# Altium schematic sheet Cell_SARA-G350-02S.SchDoc
size Letter
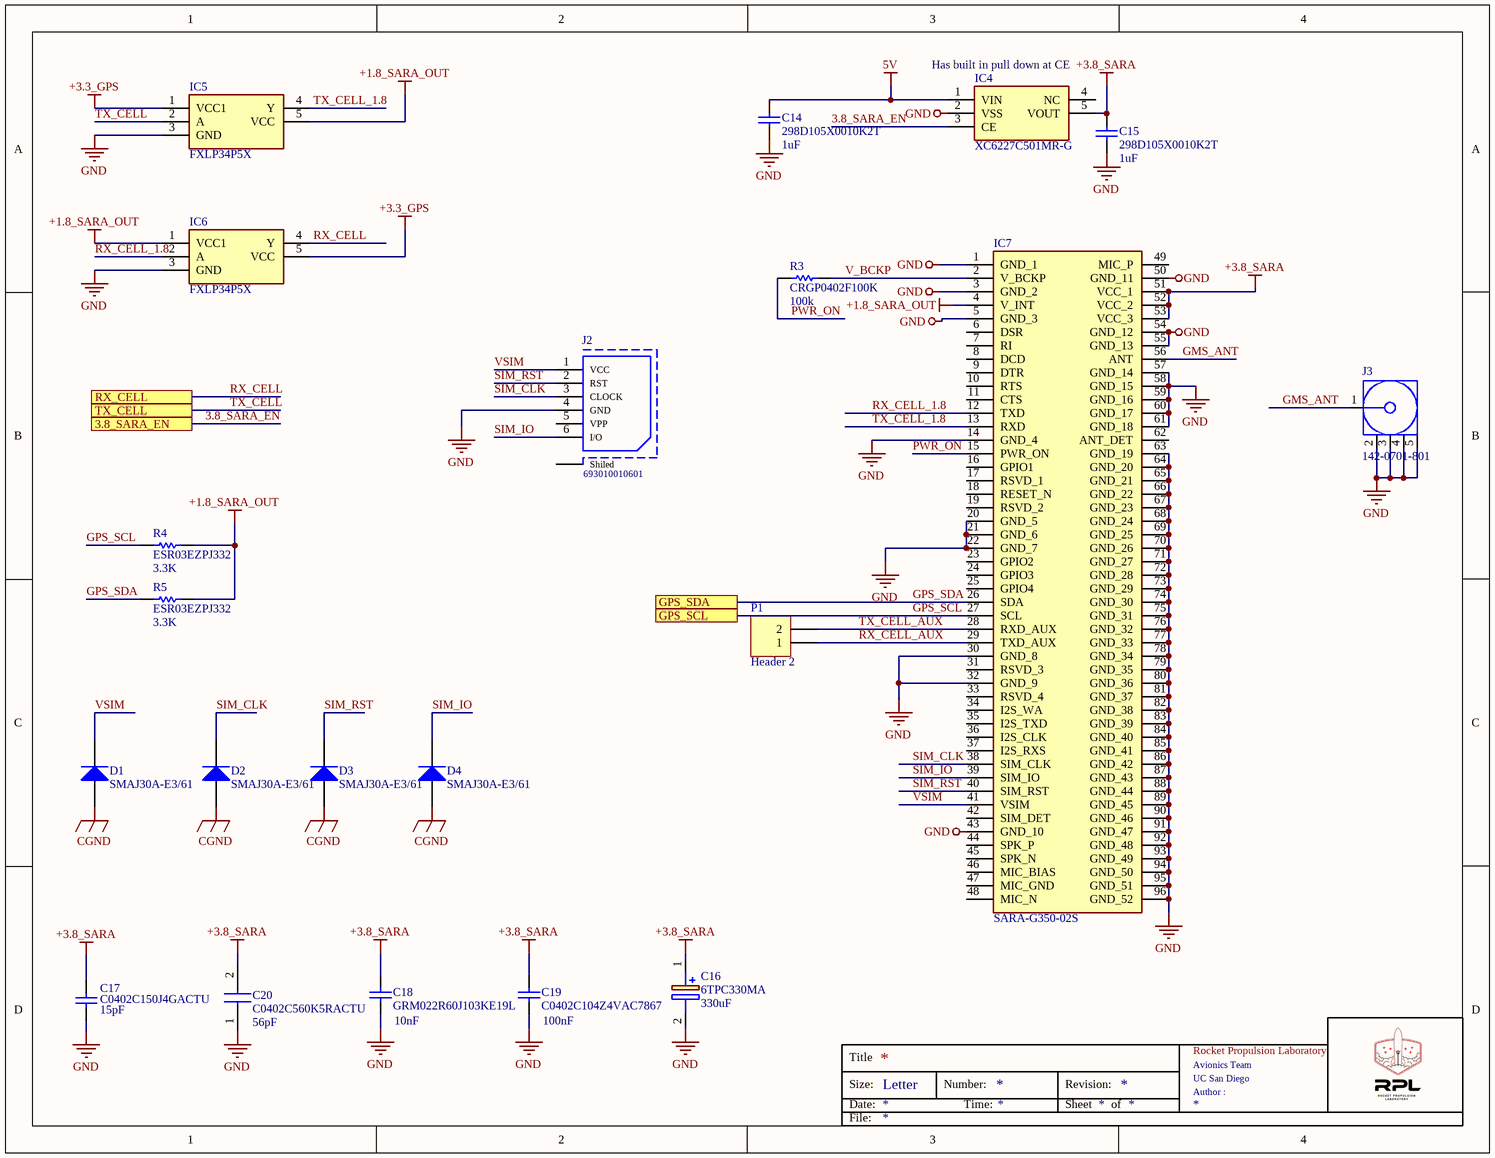
[diagram p0: Cell_SARA-G350-02S.SchDoc]

## Parts
C14  298D105X0010K2T  value 1uF  [0402]
C15  298D105X0010K2T  value 1uF  [0402]
C16  6TPC330MA  spec: 330uF  [CAPPM7343X200N]
C17  C0402C150J4GACTU  value 15pF  [CAPC0402(1005)60_L]
C18  GRM022R60J103KE19L  Spec: 10nF  [CAPC1005X55X25NL05T10]
C19  C0402C104Z4VAC7867  Spec: 100nF  [CAPC1005X60X30LL05T10]
C20  C0402C560K5RACTU  spec: 56pF  [CAPC1005X55N]
D1  SMAJ30A-E3/61  [VISH-DO-214AC-2_N]
D2  SMAJ30A-E3/61  [VISH-DO-214AC-2_N]
D3  SMAJ30A-E3/61  [VISH-DO-214AC-2_N]
D4  SMAJ30A-E3/61  [VISH-DO-214AC-2_N]
IC4  XC6227C501MR-G  [SOT95P280X130-5N]
IC5  FXLP34P5X  [SOT65P210X110-5N]
IC6  FXLP34P5X  [SOT65P210X110-5N]
IC7  SARA-G350-02S  [SARA-G350_1]
J2  693010010601  [693010010601]
J3  142-0701-801  [CINC-142-0701-801_V]
P1  Header 2  [HDR1X2]
R3  CRGP0402F100K  value 100k  [0402]
R4  ESR03EZPJ332  value 3.3K  [1608[0603]]
R5  ESR03EZPJ332  value 3.3K  [1608[0603]]

## Ports
3.8_SARA_EN, GPS_SCL, GPS_SDA, RX_CELL, TX_CELL

## Nets
5V: C14.2 IC4.1(VIN)
+1.8_SARA_OUT: IC5.5(VCC) IC6.1(VCC1) IC7.4(V_INT) R4.2 R5.2
+3.3_GPS: IC5.1(VCC1) IC6.5(VCC)
+3.8_SARA: C15.2 C16.1(+) C17.2 C18.2 C19.2 C20.2 IC4.5(VOUT) IC7.51(VCC_1) IC7.52(VCC_2) IC7.53(VCC_3)
CGND: D1.2(A) D2.2(A) D3.2(A) D4.2(A)
GND: C14.1 C15.1 C16.2(-) C17.1 C18.1 C19.1 C20.1 IC4.2(VSS) IC5.3(GND) IC6.3(GND) IC7.1(GND_1) IC7.3(GND_2) IC7.5(GND_3) IC7.14(GND_4) IC7.20(GND_5) IC7.21(GND_6) IC7.22(GND_7) IC7.30(GND_8) IC7.32(GND_9) IC7.43(GND_10) IC7.50(GND_11) IC7.54(GND_12) IC7.55(GND_13) IC7.57(GND_14) IC7.58(GND_15) IC7.59(GND_16) IC7.60(GND_17) IC7.61(GND_18) IC7.63(GND_19) IC7.64(GND_20) IC7.65(GND_21) IC7.66(GND_22) IC7.67(GND_23) IC7.68(GND_24) IC7.69(GND_25) IC7.70(GND_26) IC7.71(GND_27) IC7.72(GND_28) IC7.73(GND_29) IC7.74(GND_30) IC7.75(GND_31) IC7.76(GND_32) IC7.77(GND_33) IC7.78(GND_34) IC7.79(GND_35) IC7.80(GND_36) IC7.81(GND_37) IC7.82(GND_38) IC7.83(GND_39) IC7.84(GND_40) IC7.85(GND_41) IC7.86(GND_42) IC7.87(GND_43) IC7.88(GND_44) IC7.89(GND_45) IC7.90(GND_46) IC7.91(GND_47) IC7.92(GND_48) IC7.93(GND_49) IC7.94(GND_50) IC7.95(GND_51) IC7.96(GND_52) J2.4(GND) J3.2 J3.3 J3.4 J3.5
3.8_SARA_EN: IC4.3(CE) ; port 3.8_SARA_EN
GMS_ANT: IC7.56(ANT) J3.1
GPS_SCL: IC7.27(SCL) R4.1 ; port GPS_SCL
GPS_SDA: IC7.26(SDA) R5.1 ; port GPS_SDA
PWR_ON: IC7.15(PWR_ON) R3.2
RX_CELL: IC6.4(Y) ; port RX_CELL
RX_CELL_1.8: IC6.2(A) IC7.12(TXD)
RX_CELL_AUX: IC7.29(TXD_AUX) P1.1
SIM_CLK: D2.1(K) IC7.38(SIM_CLK) J2.3(CLOCK)
SIM_IO: D4.1(K) IC7.39(SIM_IO) J2.6(I/O)
SIM_RST: D3.1(K) IC7.40(SIM_RST) J2.2(RST)
TX_CELL: IC5.2(A) ; port TX_CELL
TX_CELL_1.8: IC5.4(Y) IC7.13(RXD)
TX_CELL_AUX: IC7.28(RXD_AUX) P1.2
V_BCKP: IC7.2(V_BCKP) R3.1
VSIM: D1.1(K) IC7.41(VSIM) J2.1(VCC)

Not connected (* = marked no-connect by the designer): IC4 4(NC); IC7 6(DSR) 7(RI) 8(DCD) 9(DTR) 10(RTS) 11(CTS) 16(GPIO1) 17(RSVD_1) 18(RESET_N) 19(RSVD_2) 23(GPIO2) 24(GPIO3) 25(GPIO4) 31(RSVD_3) 33(RSVD_4) 34(I2S_WA) 35(I2S_TXD) 36(I2S_CLK) 37(I2S_RXS) 42(SIM_DET) 44(SPK_P) 45(SPK_N) 46(MIC_BIAS) 47(MIC_GND) 48(MIC_N) 49(MIC_P) 62(ANT_DET); J2 5(VPP) Shiled

## Notes on the sheet
- (near IC4) Has built in pull down at CE
- Title
- Size:
- Date:
- Letter
- Number:
- Time:
- Revision:
- Sheet
- of
- Rocket Propulsion Laboratory
- UC San Diego
- Avionics Team
- Author :
- File:

## Library data of the parts
C14 C15 = Cap: Capacitor; Published: 8-Jun-2000; LatestRevisionDate: 17-Jul-2002; LatestRevisionNote: Re-released for DXP Platform.; PackageReference: RAD-0.3; Publisher: Altium Limited; PackageDescription: Radial Cap, Thru-Hole; 2 Leads; 0.3 in Pin Spacing
C16 = 6TPC330MA: Capacitor Polarised; Manufacturer_Name: Panasonic; Datasheet Link: https://industrial.panasonic.com/cdbs/www-data/pdf/AAA8000/AAA8000C68.pdf; Height: 2mm; Manufacturer_Part_Number: 6TPC330MA; Mouser Part Number: 667-6TPC330MA; Mouser Price/Stock: https://www.mouser.com/Search/Refine.aspx?Keyword=667-6TPC330MA; RS Part Number: 7887368P; RS Price/Stock: http://au.rs-online.com/web/p/products/7887368P
C17 = CMP-1034-00802-1: CAP 15pF 16V ±5% 0402 (1005 Metric) Thickness 0.6mm SMD; Case-EIA: 0402; Case-Metric: 1005; Tolerance: Â±5%; Max Thickness: 0.6 mm; Technology: SMT; Rated Voltage: 16 V
C18 = CMP-2008-04044-1: Manufacturer: Murata; Part Number: GRM022R60J103KE19L
C19 = CMP-2008-02369-1: Manufacturer: Kemet; Part Number: C0402C104Z4VAC7867
C20 = C0402C560K5RACTU: Capacitor; Manufacturer_Name: Kemet; Datasheet Link: https://content.kemet.com/datasheets/KEM_C1002_X7R_SMD.pdf; Height: 0.55mm; Manufacturer_Part_Number: C0402C560K5RACTU; Mouser Part Number: 80-C0402C560K5RACTU; Mouser Price/Stock: https://www.mouser.com/Search/Refine.aspx?Keyword=80-C0402C560K5RACTU
D1-D4 = CMP-0548-00228-2: Transient Voltage Suppressor, 6.40 to 231 V, 30 V Stand-off Voltage, Uni-Directional, -55 to 155 degC, 2-pin DO-214AC, Pb-Free, Tape and Reel; Manufacturer: Vishay Semiconductor; ID (uA): 1; VWM (V): 30; IFSM: 40 A; PPPM (W): 400, 300; VBR Uni-Directional (V): 6.4 to 231; Mounting Technology: Surface Mount; Packing: Tape and Reel; ComponentLink1URL: http://www.vishay.com/; ComponentLink3URL: http://www.vishay.com/docs/88390/smaj50a.pdf; DatasheetVersion: 12/8/2013; RoHS: TRUE; PartNumber: SMAJ30A-E3/61; PackageReference: DO-214AC-2; ComponentLink2URL: http://www.vishay.com/docs/88390/smaj50a.pdf; ComponentLink1Description: Manufacturer URL; Operating Junction and Storage Temperature Range: -55 to 150 degC; PackageDescription: 2-Pin DO-214AC (SMA), Body 4.245 x 2.665 mm; ComponentLink3Description: Package Specification; ComponentLink2Description: Datasheet
IC4 = XC6227C501MR-G: Integrated Circuit; Manufacturer_Name: Torex; Datasheet Link: https://www.torexsemi.com/file/xc6227/XC6227.pdf; Height: 1.3mm; Manufacturer_Part_Number: XC6227C501MR-G; Arrow Part Number: XC6227C501MR-G; Mouser Part Number: 865-XC6227C501MR-G; Mouser Price/Stock: https://www.mouser.co.uk/ProductDetail/Torex-Semiconductor/XC6227C501MR-G?qs=AsjdqWjXhJ85%252BgmQqME4lA%3D%3D
IC5 IC6 = FXLP34P5X: Integrated Circuit; Manufacturer_Name: ON Semiconductor; Datasheet Link: https://www.onsemi.com/pub/Collateral/FXLP34-D.pdf; Height: 1.1mm; Manufacturer_Part_Number: FXLP34P5X; Arrow Part Number: FXLP34P5X; Arrow Price/Stock: https://www.arrow.com/en/products/fxlp34p5x/on-semiconductor; Mouser Part Number: 512-FXLP34P5X; Mouser Price/Stock: https://www.mouser.com/Search/Refine.aspx?Keyword=512-FXLP34P5X
IC7 = SARA-G350-02S: Integrated Circuit; Manufacturer_Name: U-Blox; Datasheet Link: https://www.u-blox.com/sites/default/files/SARA-G3_DataSheet_%28UBX-13000993%29.pdf; Manufacturer_Part_Number: SARA-G350-02S
J2 = CMP-1502-00154-1: WR-CRD Mini SIM Card Connector Header; Manufacturer: Wurth Elektronik; Working Voltage: 50VAC; Rated Current: 0.5A; Withstanding Voltage: 500VAC; Publisher: WurthElektronik; Part Number: 693010010601; Operating Temperature: -25to85degC; Packaging: TapeandReel; Datasheet URL: https://katalog.we-online.de/em/datasheet/693010010601.pdf; Package Reference: 693010010601; Mounting Technology: SMT; Manufacturer URL: http://www.we-online.de
J3 = CMP-2000-05490-1: SMA End Launch Jack Receptacle, 50 Ohm, 0 to 18 GHz, -65 to 165 degC, 5-Pin SMD, RoHS, Bulk; Manufacturer: EmersonConnectivitySolutions; Connector Type: JackPCB; Gender: Jack(Female); Impedance: 50Ohms; Brand: Johnson/EmersonConnectivitySolutions; Body Material: Brass; Body Style: Straight; Maximum Frequency: 18GHz; Factory Pack Quantity: 5; Datasheet URL: https://belfuse.com/resources/Johnson/productinformation/pi-142-0701-801.pdf; Datasheet Version: 12/2014; Operating Temperature Range: -65Cto+165C; Mounting Technology: SurfaceMount; RF Series: SMA; Package Reference: 142-0701-801; Product Category: RFConnectors/CoaxialConnectors; Termination Style: Solder; RoHS: Details; Package URL: https://belfuse.com/resources/Johnson/drawings/dr-1420701801.pdf; Series: SMA; Package Description: 5-Pin Surface Mount Device, Body 14.275 x 9.525 mm; Manufacturer URL: http://www.cinch.com/; Contact Plating: Gold; Product: Connectors; Orientation: Straight
P1 = Header 2: Header, 2-Pin; LatestRevisionDate: 17-Jul-2002; LatestRevisionNote: Re-released for DXP Platform.; Publisher: Altium Limited
R3-R5 = Res1: Resistor; Published: 8-Jun-2000; LatestRevisionDate: 17-Jul-2002; LatestRevisionNote: Re-released for DXP Platform.; PackageReference: AXIAL-0.3; Publisher: Altium Limited; PackageDescription: Axial Device, Thru-Hole; 2 Leads; 0.3 in Pin Spacing